# EAGLE schematic food_dispenser (EAGLE 9.6.2)
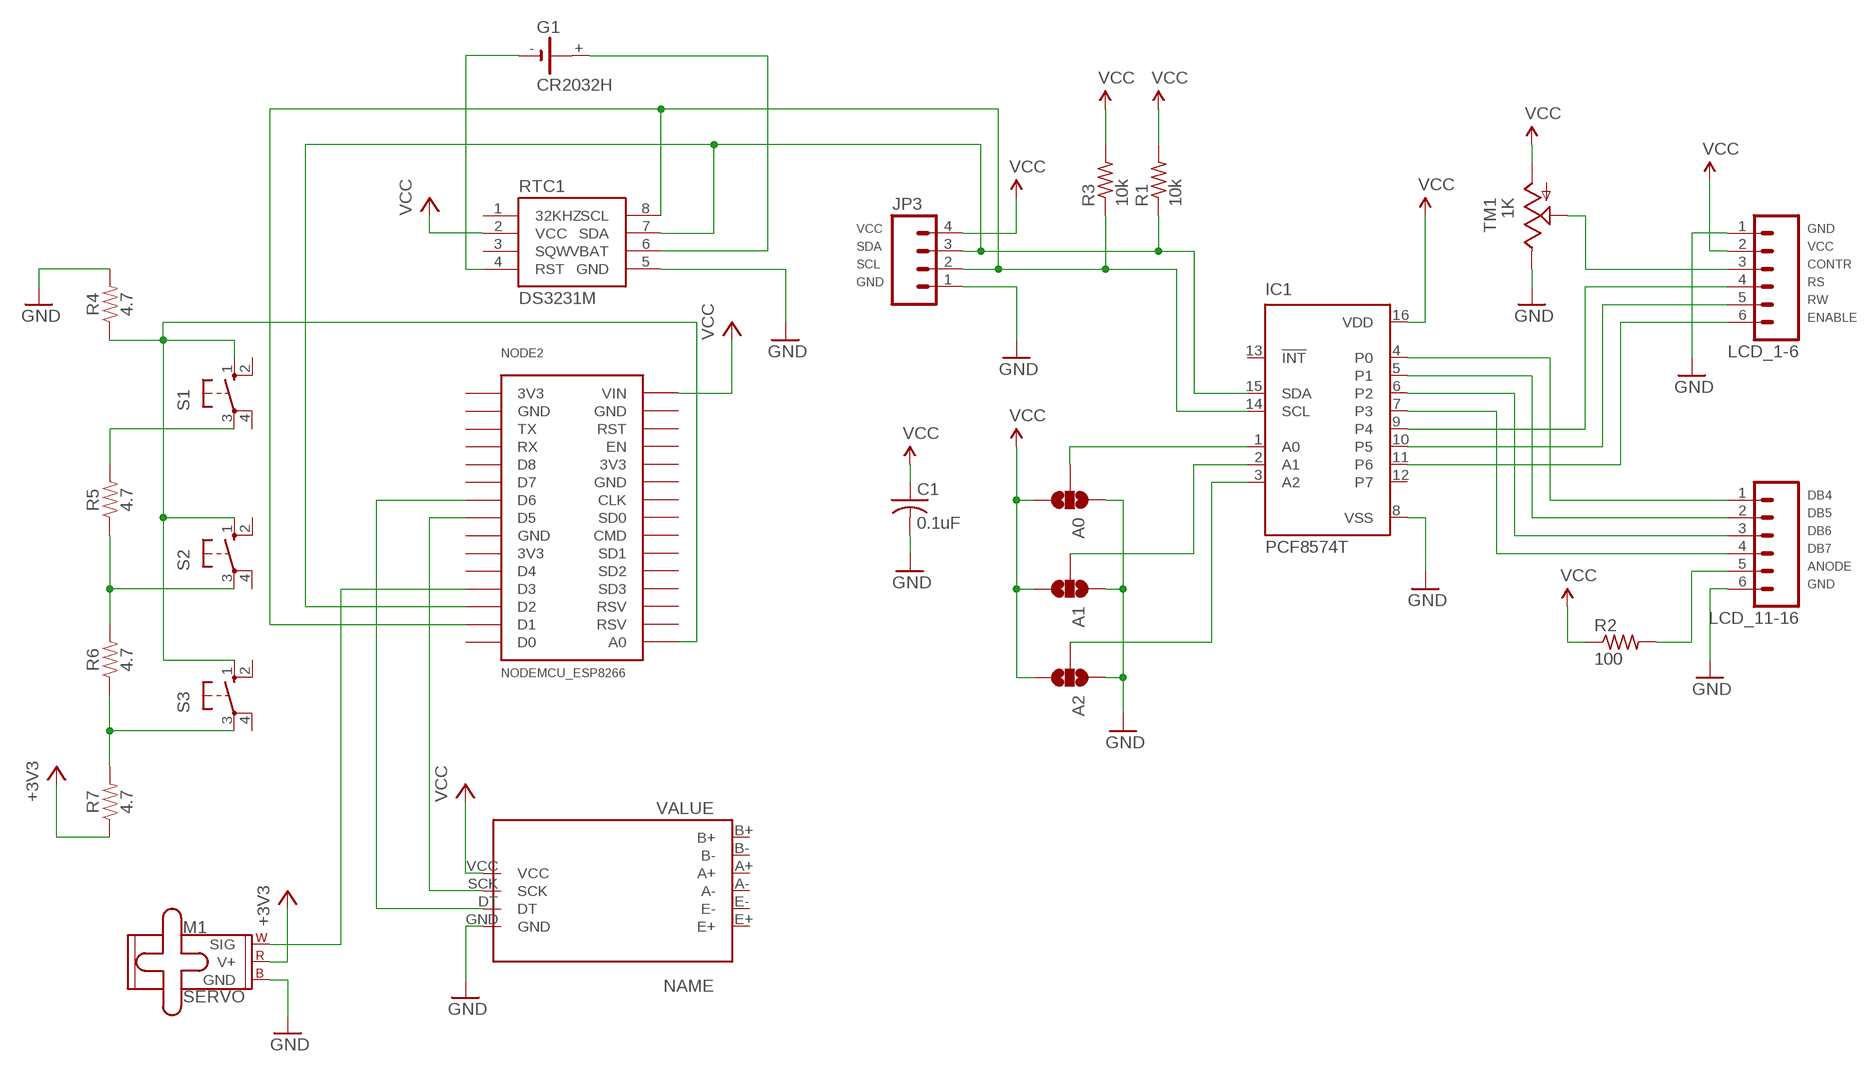
[diagram p0: schematic, sheet 1]

## Parts
A0  SOLDERJUMPER_2WAYT  [SJ_2]
A1  SOLDERJUMPER_2WAYT  [SJ_2]
A2  SOLDERJUMPER_2WAYT  [SJ_2]
C1  0.1uF  C-USC1206K  [C1206K]
G1  CR2032H  [CR2032H]
IC1  PCF8574T  [SO16W]
JP3  M04PTH  [1X04]
LCD_1-6  M06SIP  [1X06]
LCD_11-16  M06SIP  [1X06]
M1  SERVO  [1X03]
NODE2  NODEMCU_ESP8266  [NODEMCU_ESP8266]
R1  10k  R-US_R0805  [R0805]
R2  100  R-US_R0805  [R0805]
R3  10k  R-US_R0805  [R0805]
R4  4.7  4.7OHM-0402-1/16W-1%  [0402]
R5  4.7  4.7OHM-0402-1/16W-1%  [0402]
R6  4.7  4.7OHM-0402-1/16W-1%  [0402]
R7  4.7  4.7OHM-0402-1/16W-1%  [0402]
RTC1  DS3231M  [SO08]
S1  10-XX  [B3F-10XX]
S2  10-XX  [B3F-10XX]
S3  10-XX  [B3F-10XX]
TM1  1K  TRIM  [6MM]
U$1  HX711A  [HX711]

## Nets
+3V3: M1.2(V+) R7.1
A0: A0.2 IC1.1(A0)
A1: A1.2 IC1.2(A1)
A2: A2.2 IC1.3(A2)
ANODE: LCD_11-16.5 R2.2
CONTR: LCD_1-6.3 TM1.S
DB4: IC1.4(P0) LCD_11-16.1
DB5: IC1.5(P1) LCD_11-16.2
DB6: IC1.6(P2) LCD_11-16.3
DB7: IC1.7(P3) LCD_11-16.4
ENABLE: IC1.11(P6) LCD_1-6.6
GND: A0.1 A1.1 A2.1 C1.2 IC1.8(VSS) JP3.1 LCD_1-6.1 LCD_11-16.6 M1.3(GND) R4.2 RTC1.5(GND) TM1.E U$1.GND
N$1: NODE2.D6 U$1.DT
N$2: NODE2.D5 U$1.SCK
N$3: NODE2.A0 R4.1 S1.1(S) S2.1(S) S3.1(S)
N$4: M1.1(SIG) NODE2.D3
N$5: R5.2 S1.3(P)
N$6: R5.1 R6.2 S2.3(P)
N$7: R6.1 R7.2 S3.3(P)
N$8: G1.+ RTC1.6(VBAT)
N$9: G1.- RTC1.4(RST)
RS: IC1.9(P4) LCD_1-6.4
RW: IC1.10(P5) LCD_1-6.5
SCL: IC1.14(SCL) JP3.2 NODE2.D1 R3.1 RTC1.8(SCL)
SDA: IC1.15(SDA) JP3.3 NODE2.D2 R1.1 RTC1.7(SDA)
VCC: A0.3 A1.3 A2.3 C1.1 IC1.16(VDD) JP3.4 LCD_1-6.2 NODE2.VIN R1.2 R2.1 R3.2 RTC1.2(VCC) TM1.A U$1.VCC
Unconnected: G1.+@1(+) IC1.12(P7) IC1.13(!INT) NODE2.CLK NODE2.CMD NODE2.D0 NODE2.D4 NODE2.D7 NODE2.D8 NODE2.EN NODE2.RST NODE2.RSV1(RSV) NODE2.RSV2(RSV) NODE2.RX NODE2.SD1 NODE2.SD2 NODE2.SD3 NODE2.SDO(SD0) NODE2.TX RTC1.1(32KHZ) RTC1.3(SQW) S1.2(S1) S1.4(P1) S2.2(S1) S2.4(P1) S3.2(S1) S3.4(P1) U$1.A+ U$1.A- U$1.B+ U$1.B- U$1.E+ U$1.E-

## Power pins joined to a net without a drawn wire
3V3: NODE2.3V3@1(3V3) NODE2.3V3@2(3V3) NODE2.3V3@3(3V3)
GND: NODE2.GND@1(GND) NODE2.GND@2(GND) NODE2.GND@3(GND) NODE2.GND@4(GND)

## Library data of the parts
A0 A1 A2 = SparkFun:SOLDERJUMPER_2WAY: Solder Jumper 2 way solder jumper
C1 = adafruit:C-US: CAPACITOR, American symbol
G1 = battery:CR2032H: LI BATTERY Varta
IC1 = micro-philips:PCF8574: I2C-Bus Remote 8-bit I/O expander http://www.semiconductors.philips.com/acrobat_download/datasheets/PCF8574_4.pdf; MPN: PCF8574T/3,512; OC_FARNELL: 1201255; OC_NEWARK: 70R6870
JP3 = SparkFun-Connectors:M04: Header 4 Standard 4-pin 0.1" header. Use with straight break away headers (SKU : PRT-00116), right angle break away headers (PRT-00553), swiss pins (PRT-00743), machine pins (PRT-00117), and female headers (PRT-00115). Molex polarized connector foot print use with SKU : PRT-08231 with associated crimp pins and housings. 1MM SMD Version SKU: PRT-10208
LCD_1-6 LCD_11-16 = SparkFun-Connectors:M06: Header 6 Standard 6-pin 0.1" header. Use with straight break away headers (SKU : PRT-00116), right angle break away headers (PRT-00553), swiss pins (PRT-00743), machine pins (PRT-00117), and female headers (PRT-00115). Molex polarized connector foot print use with SKU : PRT-08094 with associated crimp pins and housings. NOTES ON THE VARIANTS LOCK and LOCK_LONGPADS... This footprint was designed to help hold the alignment of a through-hole component (i.e. 6-pin header) while soldering it into place. You may notice that each hole has been shifted either up or down by 0.005 of an inch from it's more standard position (which is a perfectly straight line). This slight alteration caused the pins (the squares in the middle) to touch the edges of the holes. Because they are alternating, it causes a "brace" to hold the component in place. 0.005 has proven to be the perfect amount of "off-center" position when using our standard breakaway headers. Although looks a little odd when you look at the bare footprint, once you have a header in there, the alteration is very hard to notice. Also, if you push a header all the way into place, it is covered up entirely on the bottom side. This idea of altering the position of holes to aid alignment will be further integrated into the Sparkfun Library for other footprints. It can help hold any component with 3 or more connection pins.
M1 = SparkFun-Electromechanical:SERVO: Servo Motor 3-pin connector for a standard servo motor (voltage supply, ground, and control signal.) SparkFun Products Servo - Generic (Sub-Micro Size) <https://www.sparkfun.com/products/9065> (ROB-09065) Servo - Generic High Torque Continuous Rotation (Standard Size) <https://www.sparkfun.com/products/9347> (ROB-09347) Servo - Generic High Torque (Standard Size) <https://www.sparkfun.com/products/11965> (ROB-11965)
NODE2 = nodemcu_esp8266:NODEMCU_ESP8266: Node MCU V2 (ESP8266) Created by Harish
R1-R3 = adafruit:R-US_: RESISTOR, American symbol
R4-R7 = SparkFun-Resistors:4.7OHM: 4.7Ω resistor A resistor is a passive two-terminal electrical component that implements electrical resistance as a circuit element. Resistors act to reduce current flow, and, at the same time, act to lower voltage levels within circuits. - Wikipedia; PROD_ID: RES-16312
RTC1 = SparkFun-Clocks:DS3231M: DS3231M Real Time Clock Accuracy +/-5ppm. Battery Backup. 2.3V to 5.5V. Datasheet <https://cdn.sparkfun.com/datasheets/Dev/Beagle/DS3231M.pdf> SparkFun Products CryptoCape <https://www.sparkfun.com/products/12773> (DEV-12773) SparkFun CryptoShield <https://www.sparkfun.com/products/13183> (DEV-13183); PROD_ID: IC-11985
S1-S3 = switch-omron:10-XX: OMRON SWITCH; MPN: B3F-1000; OC_FARNELL: 176432; OC_NEWARK: 36M3542
TM1 = adafruit:TRIM
U$1 = HX711:HX711